# EAGLE design transfo_schematic (EAGLE 9.6.2)
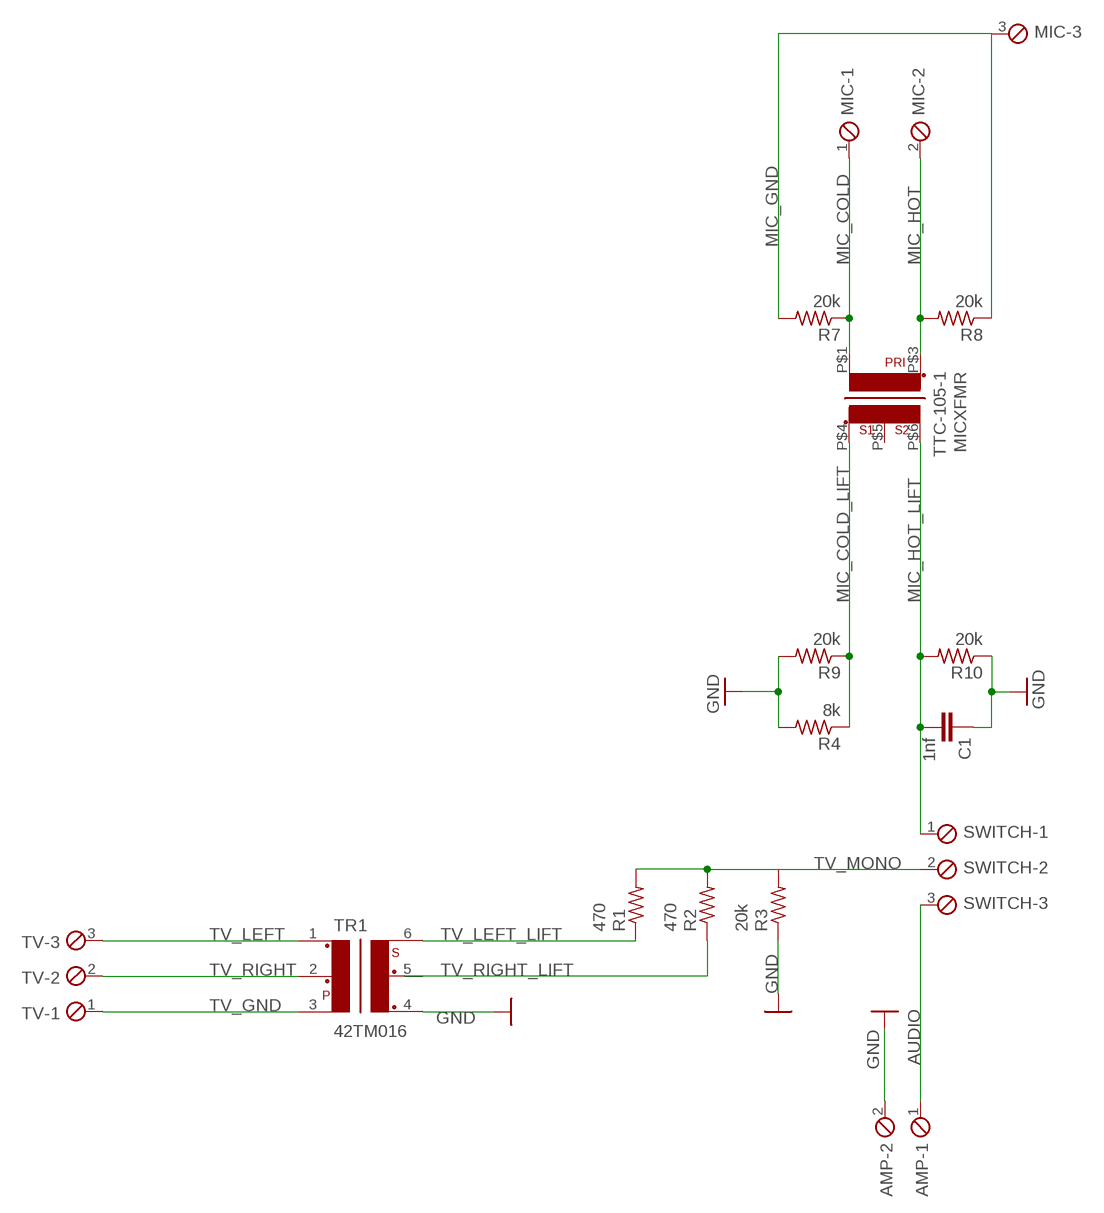
[diagram p0: schematic, sheet 1]

## Parts
AMP  TB3POL  MKDS1/2-3,81  [2POL381]
C1  1nf  0.1UF-KIT-EZ-50V-20%  [CAP-PTH-SMALL-KIT]
MIC  TB3POL  MKDS1/3-3,81  [3POL381]
MICXFMR  TTC-105-1  TAMURA-TTC-105-1  [TAMURA-TTC-105-1]
R1  470  R-US_0204/7  [0204/7]
R2  470  R-US_0204/7  [0204/7]
R3  20k  R-US_0204/7  [0204/7]
R4  8k  R-US_0204/7  [0204/7]
R7  20k  R-US_0204/7  [0204/7]
R8  20k  R-US_0204/7  [0204/7]
R9  20k  R-US_0204/7  [0204/7]
R10  20k  R-US_0204/7  [0204/7]
SWITCH  TB3POL  MKDS1/3-3,81  [3POL381]
TR1  42TM016  [42TM]
TV  TB3POL  MKDS1/3-3,81  [3POL381]

## Nets
AUDIO: AMP.1 SWITCH.3
GND: AMP.2 C1.1 R3.1 R4.2 R9.2 R10.1 TR1.4
MIC_COLD: MIC.1 MICXFMR.P$1 R7.1
MIC_COLD_LIFT: MICXFMR.P$4 R4.1 R9.1
MIC_GND: MIC.3 R7.2 R8.1
MIC_HOT: MIC.2 MICXFMR.P$3 R8.2
MIC_HOT_LIFT: C1.2 MICXFMR.P$6 R10.2 SWITCH.1
TV_GND: TR1.3 TV.1
TV_LEFT: TR1.1 TV.3
TV_LEFT_LIFT: R1.1 TR1.6
TV_MONO: R1.2 R2.2 R3.2 SWITCH.2
TV_RIGHT: TR1.2 TV.2
TV_RIGHT_LIFT: R2.1 TR1.5
Unconnected: MICXFMR.P$5

## Library data of the parts
AMP = con-phoenix-381:MKDS1/2-3,81: MKDS 1/2-3,81 - Order No. 1727010 (RS-Online - 101-5384) Pitch: 3,81mm Number of terminals: 2 Rated Voltage: 160V Maximum load current/ cross section: 12A/1.5mm2-AWG16 Housing Interlocking: none Color: Green
C1 = SparkFun-Capacitors:0.1UF: 0.1µF ceramic capacitors A capacitor is a passive two-terminal electrical component used to store electrical energy temporarily in an electric field.; PROD_ID: CAP-08370; VALUE: 0.1uF
MIC SWITCH TV = con-phoenix-381:MKDS1/3-3,81: MKDS 1/3-3,81 - Order No. 1727023 (RS-Online - 101-5390) Pitch: 3,81mm Number of terminals: 3 Rated Voltage: 160V Maximum load current/ cross section: 12A/1.5mm2-AWG16 Housing Interlocking: none Color: Green
MICXFMR = adam - passive:TAMURA-TTC-105-1: Tamura 600:600CT transformer operates with 90mADC wet for telephony applications
R1-R4 R7-R10 = adafruit:R-US_: RESISTOR, American symbol
TR1 = trafo-xicon:42T?*: Xicon Micro-Mini EI-12 Audio Transformers 42TL/42TC/42TM Series Source: http://www.mouser.com//catalog/specsheets/164201.pdf http://www.mouser.com/catalog/specsheets/114225.pdf http://www.mouser.com/catalog/specsheets/164267.pdf; OC_FARNELL: unknown; OC_NEWARK: unknown

## Board
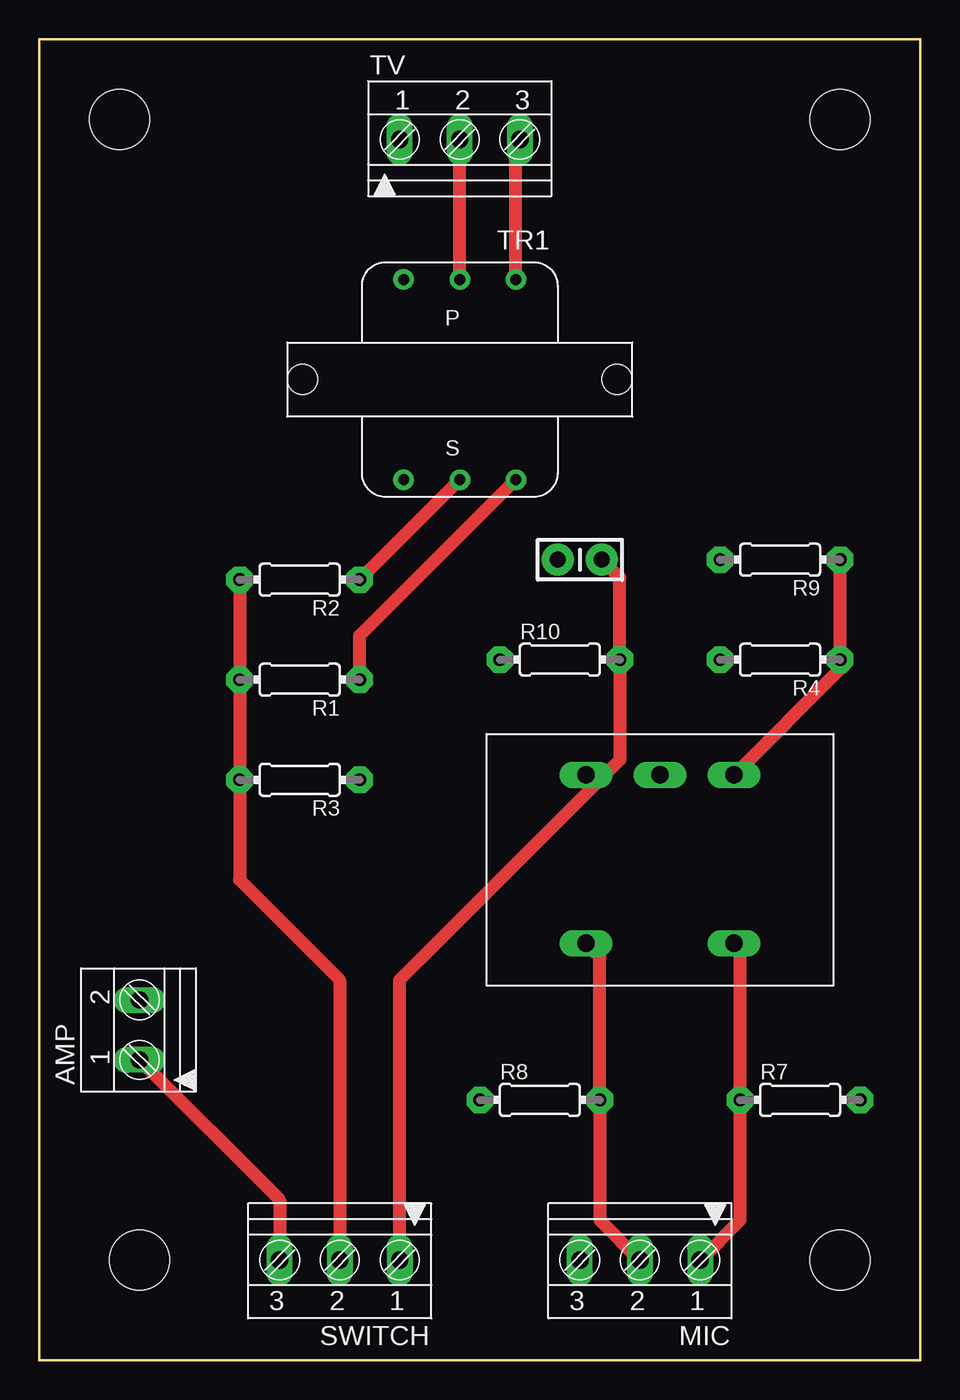
[diagram p1: board, top side]
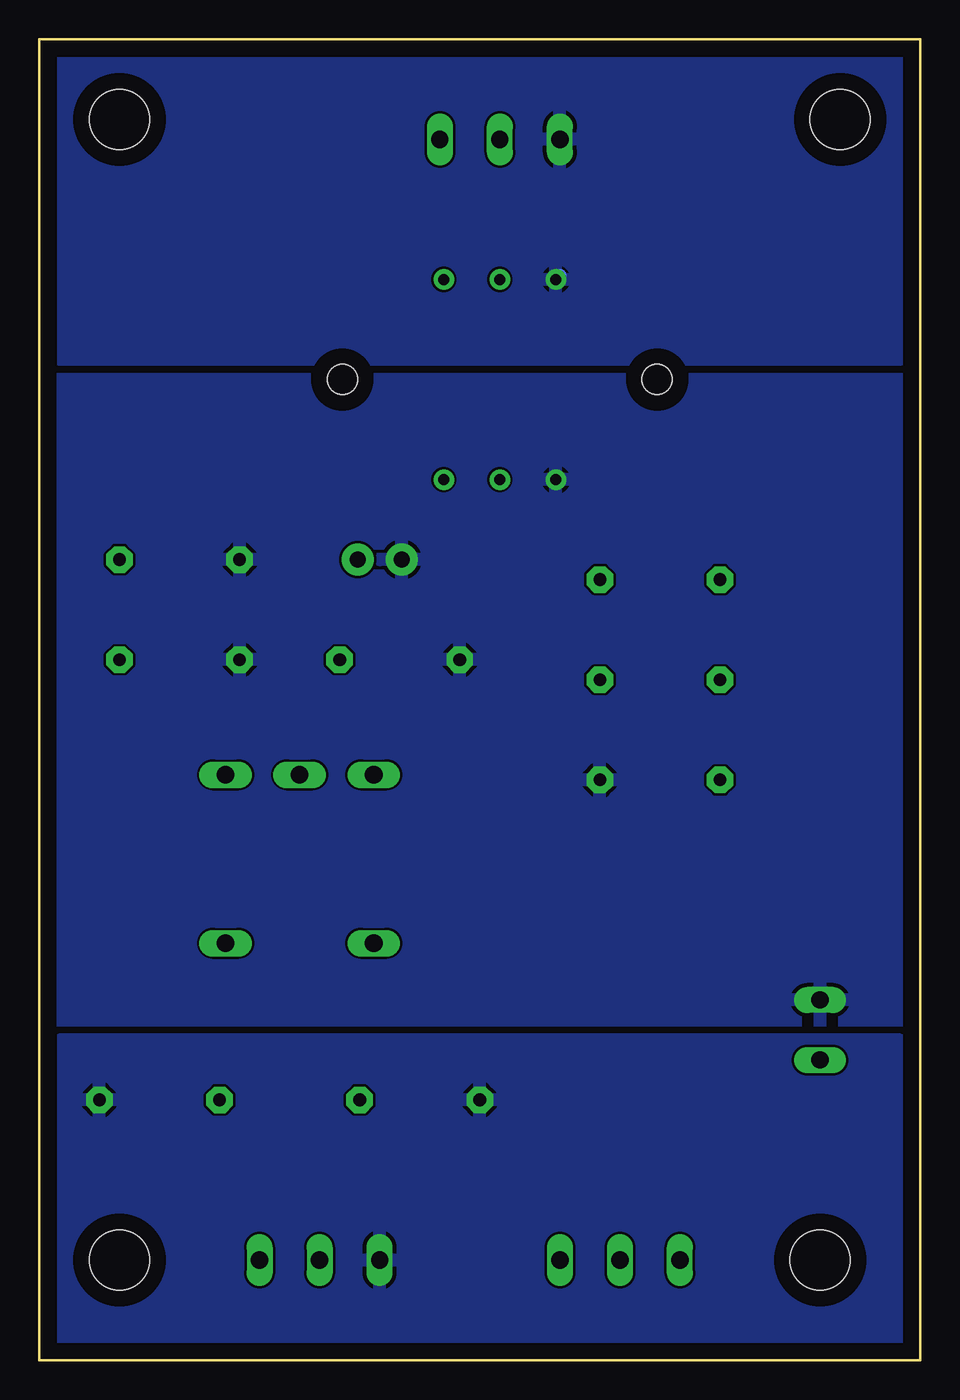
[diagram p2: board, bottom side, seen from below]

Size 55.88 x 83.82 mm. Coordinates in mm from the lower left corner, seen from the top.
Outline: 0,0 55.88,0 55.88,83.82 0,83.82 0,0
Copper layers (1*16): Top 0.035mm / dielectric 1.5mm / Bottom 0.035mm
Design rules "default": minimum track width 6mil, minimum drill 0.35mm, track to track 6mil, track to pad 6mil, pad to pad 6mil, via to via 6mil, smd to smd 6mil, copper to edge 40mil, drill to drill 6mil, minimum pad ring 10mil, minimum via ring 8mil, stop-mask expansion 4mil, vias tented up to drill 0mil, thermal gap 10mil
Holes 3.81 mm at 5.08,78.74 50.8,78.74 6.35,6.35 50.8,6.35

### Footprints (pad centres in the part's own frame; a part is rotated, then mirrored left to right if it is on the bottom)
2POL381 = drill 1.1 long: 1 0,0; 2 3.81,0
CAP-PTH-SMALL-KIT = drill 1.016 pad 2.032: 1 -1.397,0; 2 1.397,0
3POL381 = drill 1.1 long: 1 0,0; 2 3.81,0; 3 7.62,0
TAMURA-TTC-105-1 = drill 1.118 pad 1.676 long: P$1 -5.3,-4.7; P$3 -5.3,4.7; P$4 5.4,-4.7; P$5 5.4,0; P$6 5.4,4.7
0204/7 = drill 0.813 pad 1.676 octagon: 1 -3.81,0; 2 3.81,0
42TM = drill 0.7 pad 1.3: 1 -3.556,-6.35; 2 0,-6.35; 3 3.556,-6.35; 4 3.556,6.35; 5 0,6.35; 6 -3.556,6.35 | hole 1.9: -9.982,0; 9.982,0

### Placement (x,y rotation side)
AMP  6.35,19.05 90 top
C1  34.29,50.8 0 top
MIC  41.91,6.35 180 top
MICXFMR  39.37,31.75 90 top
R1  16.51,43.18 180 top
R2  16.51,49.53 180 top
R3  16.51,36.83 180 top
R4  46.99,44.45 180 top
R7  48.26,16.51 0 top
R8  31.75,16.51 0 top
R9  46.99,50.8 180 top
R10  33.02,44.45 0 top
SWITCH  22.86,6.35 180 top
TR1  26.67,62.23 180 top
TV  22.86,77.47 0 top

### Tracks (layer width: path | path; a pad name or v marks a point on that pad's centre or on a via)
AUDIO
  Top 0.813: AMP.1 15.24,10.16 SWITCH.3
GND
  pour Bottom: 0,62.23 55.88,62.23 55.88,21.59 0,21.59
MIC_COLD
  Top 0.813: MIC.1 44.45,8.89 R7.1 44.45,26.07 MICXFMR.P$1
MIC_COLD_LIFT
  Top 0.813: MICXFMR.P$4 50.8,43.88 R4.1 R9.1
MIC_GND
  pour Bottom: 1.27,0 1.27,20.32 54.61,20.32 54.61,0
MIC_HOT
  Top 0.813: MICXFMR.P$3 35.56,25.56 R8.2 35.56,8.89 MIC.2
MIC_HOT_LIFT
  Top 0.813: 34.67,37.21 MICXFMR.P$6 35.88,37.15 | SWITCH.1 22.86,24.13 35.88,37.15 | C1.2 36.83,49.66 R10.2 36.83,38.1 35.88,37.15
TV_GND
  Bottom 0.813: TR1.3 22.86,68.83
  pour Bottom: 1.27,82.55 1.27,63.5 54.61,63.5 54.61,82.55
TV_LEFT
  Top 0.813: TR1.1 30.23,77.22 TV.3
TV_LEFT_LIFT
  Top 0.813: R1.1 20.32,45.97 TR1.6
TV_MONO
  Top 0.813: R2.2 R1.2 R3.2 12.7,30.48 19.05,24.13 SWITCH.2
TV_RIGHT
  Top 0.813: TR1.2 TV.2
TV_RIGHT_LIFT
  Top 0.813: R2.1 TR1.5